# Altium schematic sheet MCU.SchDoc
size Letter
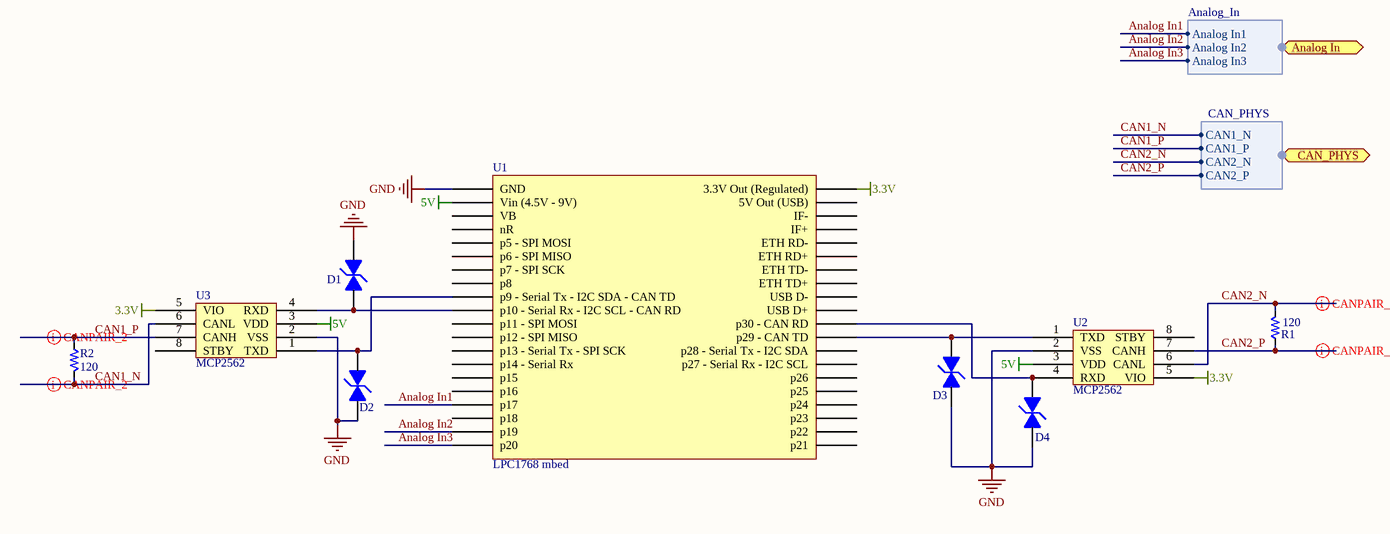
[diagram p0: MCU.SchDoc]

## Parts
D1  TVS Diode  [TVS Diode]  (value not drawn)
D2  TVS Diode  [TVS Diode]  (value not drawn)
D3  TVS Diode  [TVS Diode]  (value not drawn)
D4  TVS Diode  [TVS Diode]  (value not drawn)
R1  120  [PCB_GENERIC_SMD_0603]
R2  120  [PCB_GENERIC_SMD_0603]
U1  LPC1768 mbed  [LPC 1768 mbed Layout]
U2  MCP2562  [MCP2562]
U3  MCP2562  [MCP2562]

## Ports
Analog In (harness Analog_In), CAN_PHYS (harness CAN_PHYS)

## Harnesses
Analog_In: Analog In1, Analog In2, Analog In3
CAN_PHYS: CAN1_N, CAN1_P, CAN2_N, CAN2_P

## Nets
3.3V: U1.40(3.3V_Out_(Regulated)) U2.5(VIO) U3.5(VIO)
5V: U1.2(Vin_(4.5V_-_9V)) U2.3(VDD) U3.3(VDD)
GND: D1.2 D2.2 D3.1 D4.1 U1.1(GND) U2.2(VSS) U3.2(VSS)
Analog In1: U1.17(p17) ; port Analog In.Analog In1
Analog In2: U1.19(p19) ; port Analog In.Analog In2
Analog In3: U1.20(p20) ; port Analog In.Analog In3
CAN1_N: R2.2 U3.6(CANL) ; port CAN_PHYS.CAN1_N
CAN1_P: R2.1 U3.7(CANH) ; port CAN_PHYS.CAN1_P
CAN2_N: R1.2 U2.6(CANL) ; port CAN_PHYS.CAN2_N
CAN2_P: R1.1 U2.7(CANH) ; port CAN_PHYS.CAN2_P
NetD1_1: D1.1 U1.10(p10_-_Serial_Rx_-_I2C_SCL_-_CAN_RD) U3.4(RXD)
NetD2_1: D2.1 U1.9(p9_-_Serial_Tx_-_I2C_SDA_-_CAN_TD) U3.1(TXD)
NetD3_2: D3.2 U1.29(p29_-_CAN_TD) U2.1(TXD)
NetD4_2: D4.2 U1.30(p30_-_CAN_RD) U2.4(RXD)

Not connected (* = marked no-connect by the designer): U1 3(VB) 4(nR) 5(p5_-_SPI_MOSI) 6(p6_-_SPI_MISO) 7(p7_-_SPI_SCK) 8(p8) 11(p11_-_SPI_MOSI) 12(p12_-_SPI_MISO) 13(p13_-_Serial_Tx_-_SPI_SCK) 14(p14_-_Serial_Rx) 15(p15) 16(p16) 18(p18) 21(p21) 22(p22) 23(p23) 24(p24) 25(p25) 26(p26) 27(p27_-_Serial_Rx_-_I2C_SCL) 28(p28_-_Serial_Tx_-_I2C_SDA) 31(USB_D+) 32(USB_D-) 33(ETH_TD+) 34(ETH_TD-) 35(ETH_RD+) 36(ETH_RD-) 37(IF+) 38(IF-) 39(5V_Out_(USB)); U2 8(STBY); U3 8(STBY)

## Layout directives
differential pair: CAN1_N, CAN1_P, CAN2_N, CAN2_P

## Library data of the parts
D1-D4 = TVS Diode: Manufacturer: Bourns; Manufacturer ID: CDSOD323-T03SC
R1 R2 = SCH_GENERIC_RESISTOR_0603: 120 Ohms; Resistance: 120